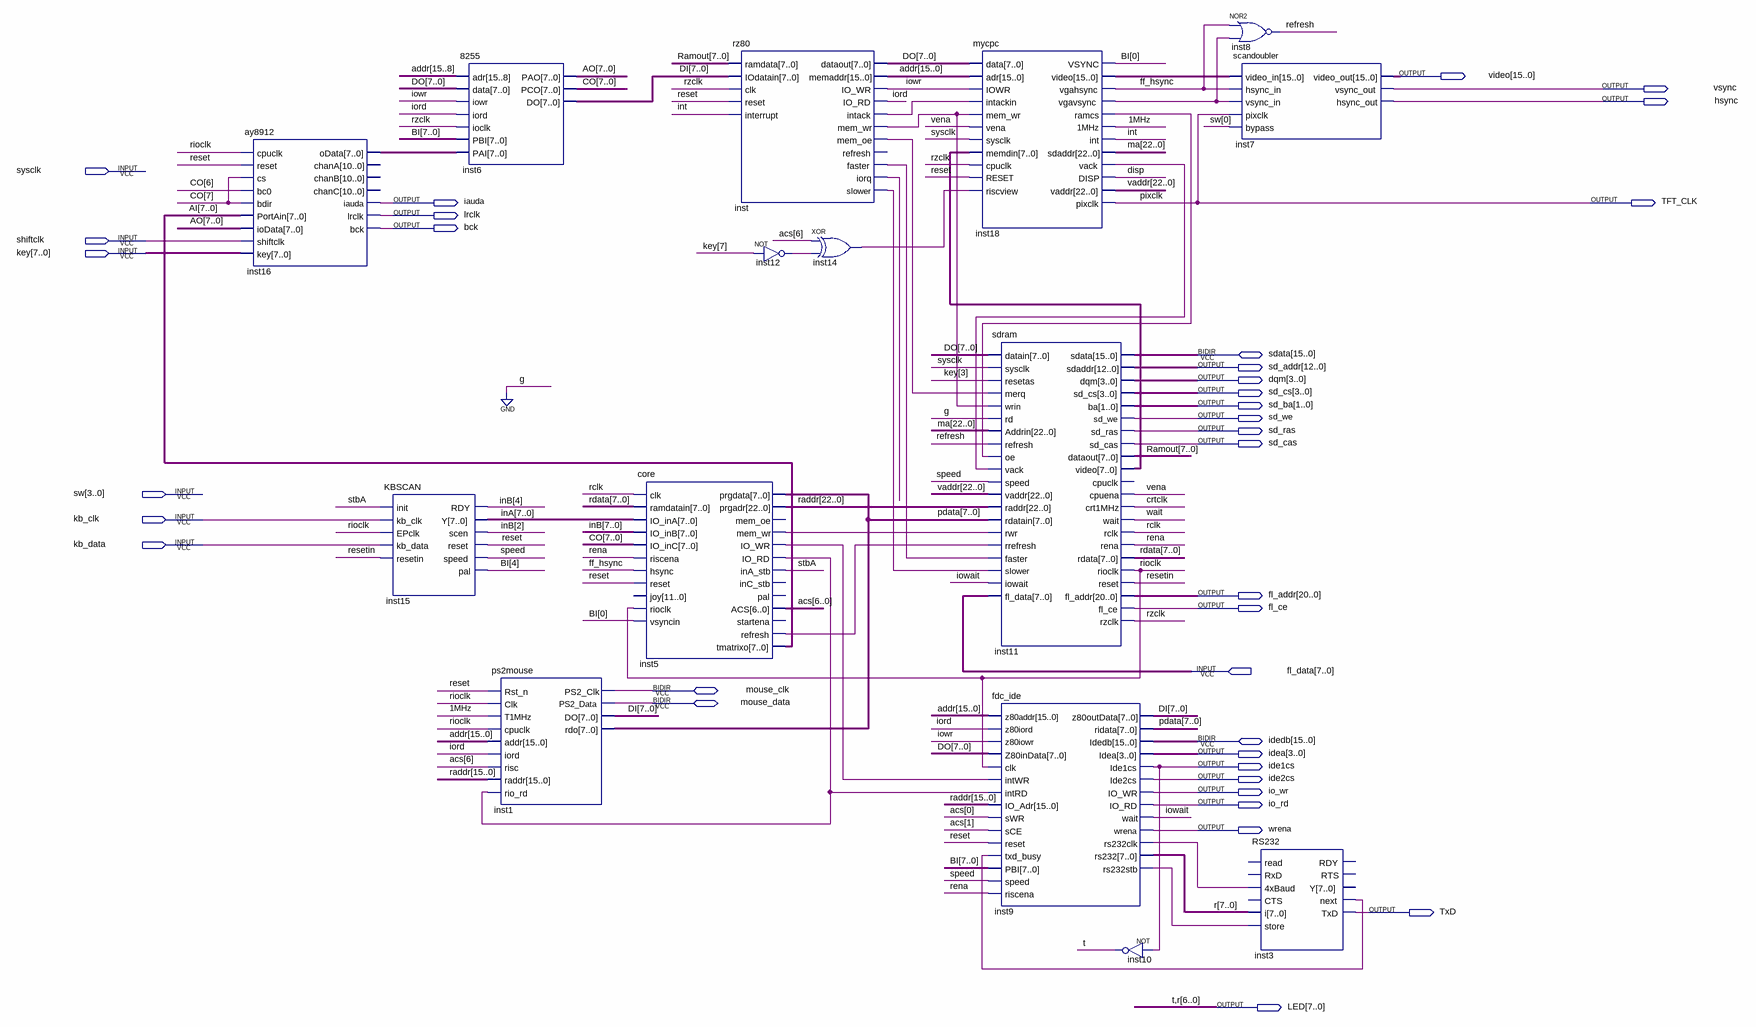
[diagram p0: schematic sheet]
// Quartus schematic a1k100.bdf as structural Verilog: 15 symbols, 35 pins
module a1k100 (
  input  sysclk,
  input  shiftclk,
  input  [7:0] key,
  input  [3:0] sw,
  input  kb_clk,
  input  kb_data,
  input  [7:0] fl_data,
  inout  [15:0] sdata,
  inout  mouse_clk,
  inout  mouse_data,
  inout  [15:0] idedb,
  output [15:0] video,
  output vsync,
  output hsync,
  output iauda,
  output TFT_CLK,
  output lrclk,
  output bck,
  output [12:0] sd_addr,
  output [3:0] dqm,
  output [3:0] sd_cs,
  output [1:0] sd_ba,
  output sd_we,
  output sd_ras,
  output sd_cas,
  output [20:0] fl_addr,
  output fl_ce,
  output [3:0] idea,
  output ide1cs,
  output ide2cs,
  output io_wr,
  output io_rd,
  output wrena,
  output TxD,
  output [7:0] LED
);

  wire \1MHz , crtclk, disp, ff_hsync, inst3_next, inst5_io_rd, inst5_io_wr, inst5_mem_wr, inst5_refresh,
       inst9_rs232clk, inst9_rs232stb, inst12_out, inst14_out, inst18_ramcs, inst18_vack, inst18_vgavsync,
       inst_faster, inst_intack, inst_iorq, inst_mem_oe, inst_mem_wr, inst_slower, \int , iord, iowait, iowr,
       rclk, refresh, rena, reset, resetin, rioclk, rzclk, speed, stbA, vena, \wait ;
  wire [6:0] acs;
  wire [7:0] AI, AO, BI, CO, DI, DO, inA, inB, inst11_video, inst16_odata, pdata, Ramout, rdata;
  wire [7:7] r;
  wire [15:0] addr, inst18_video;
  wire [22:0] ma, raddr, vaddr;

  ay8912 inst16 (
    .cpuclk(rioclk), .reset(reset), .cs(CO[7]), .bc0(CO[6]), .bdir(CO[7]), .PortAin(AI), .ioData(AO),
    .shiftclk(shiftclk), .key(key), .oData(inst16_odata), .iauda(iauda), .lrclk(lrclk), .bck(bck));  // open: chanA, chanB, chanC
  KBSCAN inst15 (
    .init(stbA), .kb_clk(kb_clk), .EPclk(rioclk), .kb_data(kb_data), .resetin(resetin), .RDY(inB[4]),
    .Y(inA), .scen(inB[2]), .reset(reset), .speed(speed), .pal(BI[4]));
  \8255  inst6 (
    .adr(addr[15:8]), .data(DO), .iowr(iowr), .iord(iord), .ioclk(rzclk), .PBI(BI), .PAI(inst16_odata),
    .PAO(AO), .PCO(CO), .DO(DI));
  ps2mouse inst1 (
    .Rst_n(reset), .Clk(rioclk), .T1MHz(\1MHz ), .cpuclk(rioclk), .addr(addr), .iord(iord), .risc(acs[6]),
    .raddr(raddr[15:0]), .rio_rd(inst5_io_rd), .DO(DI), .rdo(pdata), .PS2_Clk(mouse_clk),
    .PS2_Data(mouse_data));
  core inst5 (
    .clk(rclk), .ramdatain(rdata), .IO_inA(inA), .IO_inB(inB), .IO_inC(CO), .riscena(rena), .hsync(ff_hsync),
    .reset(reset), .rioclk(rioclk), .vsyncin(BI[0]), .prgadr(raddr), .mem_wr(inst5_mem_wr),
    .IO_WR(inst5_io_wr), .IO_RD(inst5_io_rd), .inA_stb(stbA), .ACS(acs), .refresh(inst5_refresh),
    .tmatrixo(AI), .prgdata(pdata));  // open: joy, mem_oe, inC_stb, pal, startena
  rz80 inst (
    .ramdata(Ramout), .IOdatain(DI), .clk(rzclk), .reset(reset), .interrupt(\int ), .dataout(DO),
    .memaddr(addr), .IO_WR(iowr), .IO_RD(iord), .intack(inst_intack), .mem_wr(inst_mem_wr),
    .mem_oe(inst_mem_oe), .faster(inst_faster), .iorq(inst_iorq), .slower(inst_slower));  // open: refresh
  not inst12 (inst12_out, key[7]);
  xor inst14 (inst14_out, acs[6], inst12_out);
  mycpc inst18 (
    .data(DO), .adr(addr), .IOWR(iowr), .intackin(inst_intack), .mem_wr(inst_mem_wr), .vena(vena),
    .sysclk(sysclk), .memdin(inst11_video), .cpuclk(rzclk), .RESET(reset), .riscview(inst14_out),
    .VSYNC(BI[0]), .video(inst18_video), .vgahsync(ff_hsync), .vgavsync(inst18_vgavsync),
    .ramcs(inst18_ramcs), .\1MHz (\1MHz ), .\int (\int ), .sdaddr(ma), .vack(inst18_vack), .DISP(disp),
    .vaddr(vaddr), .pixclk(TFT_CLK));
  sdram inst11 (
    .datain(DO), .sysclk(sysclk), .resetas(key[3]), .merq(inst_mem_oe), .wrin(inst_mem_wr), .rd(1'b0),
    .Addrin(ma), .refresh(refresh), .oe(inst18_ramcs), .vack(inst18_vack), .speed(speed), .vaddr(vaddr),
    .raddr(raddr), .rdatain(pdata), .rwr(inst5_mem_wr), .rrefresh(inst5_refresh), .faster(inst_faster),
    .slower(inst_slower), .iowait(iowait), .fl_data(fl_data), .sdaddr(sd_addr), .dqm(dqm), .sd_cs(sd_cs),
    .ba(sd_ba), .sd_we(sd_we), .sd_ras(sd_ras), .sd_cas(sd_cas), .dataout(Ramout), .video(inst11_video),
    .cpuena(vena), .crt1MHz(crtclk), .\wait (\wait ), .rclk(rclk), .rena(rena), .rdata(rdata),
    .rioclk(rioclk), .reset(resetin), .fl_addr(fl_addr), .fl_ce(fl_ce), .rzclk(rzclk), .sdata(sdata));  // open: cpuclk
  fdc_ide inst9 (
    .z80addr(addr), .z80iord(iord), .z80iowr(iowr), .Z80inData(DO), .clk(rioclk), .intWR(inst5_io_wr),
    .intRD(inst5_io_rd), .IO_Adr(raddr[15:0]), .sWR(acs[0]), .sCE(acs[1]), .reset(reset),
    .txd_busy(inst3_next), .PBI(BI), .speed(speed), .riscena(rena), .z80outData(DI), .Idea(idea),
    .Ide1cs(ide1cs), .Ide2cs(ide2cs), .IO_WR(io_wr), .IO_RD(io_rd), .\wait (iowait), .wrena(wrena),
    .rs232clk(inst9_rs232clk), .rs232({r[7], LED[6:0]}), .rs232stb(inst9_rs232stb), .ridata(pdata),
    .Idedb(idedb));
  not inst10 (LED[7], ide1cs);
  nor inst8 (refresh, ff_hsync, inst18_vgavsync);
  scandoubler inst7 (
    .video_in(inst18_video), .hsync_in(ff_hsync), .vsync_in(inst18_vgavsync), .pixclk(TFT_CLK),
    .bypass(sw[0]), .video_out(video), .vsync_out(vsync), .hsync_out(hsync));
  RS232 inst3 (
    .\4xBaud (inst9_rs232clk), .i({r[7], LED[6:0]}), .store(inst9_rs232stb), .next(inst3_next), .TxD(TxD));  // open: read, RxD, CTS, RDY, RTS, Y

  // Other names for the same wires on the sheet: pixclk = TFT_CLK; r[6:0] = LED[6:0]; t = LED[7]
endmodule
